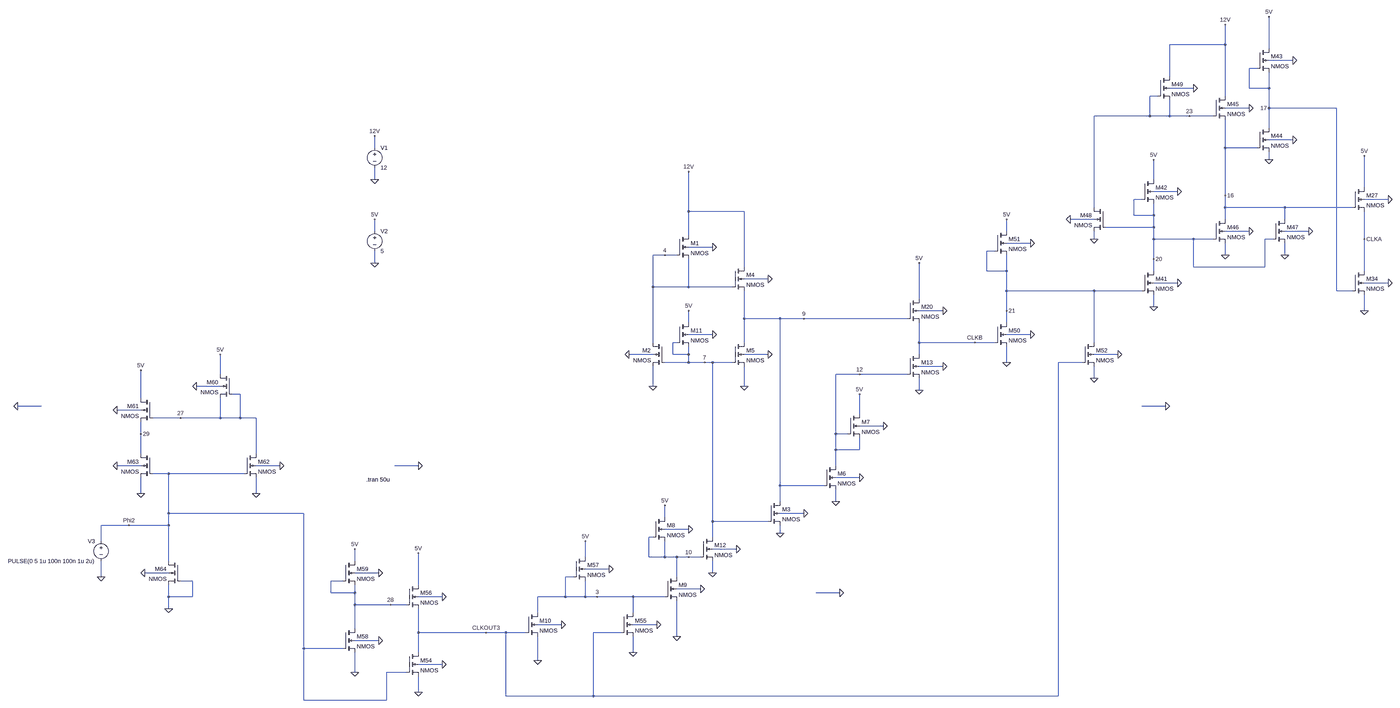
[diagram p0: schematic CLKIN.asc, whole sheet]
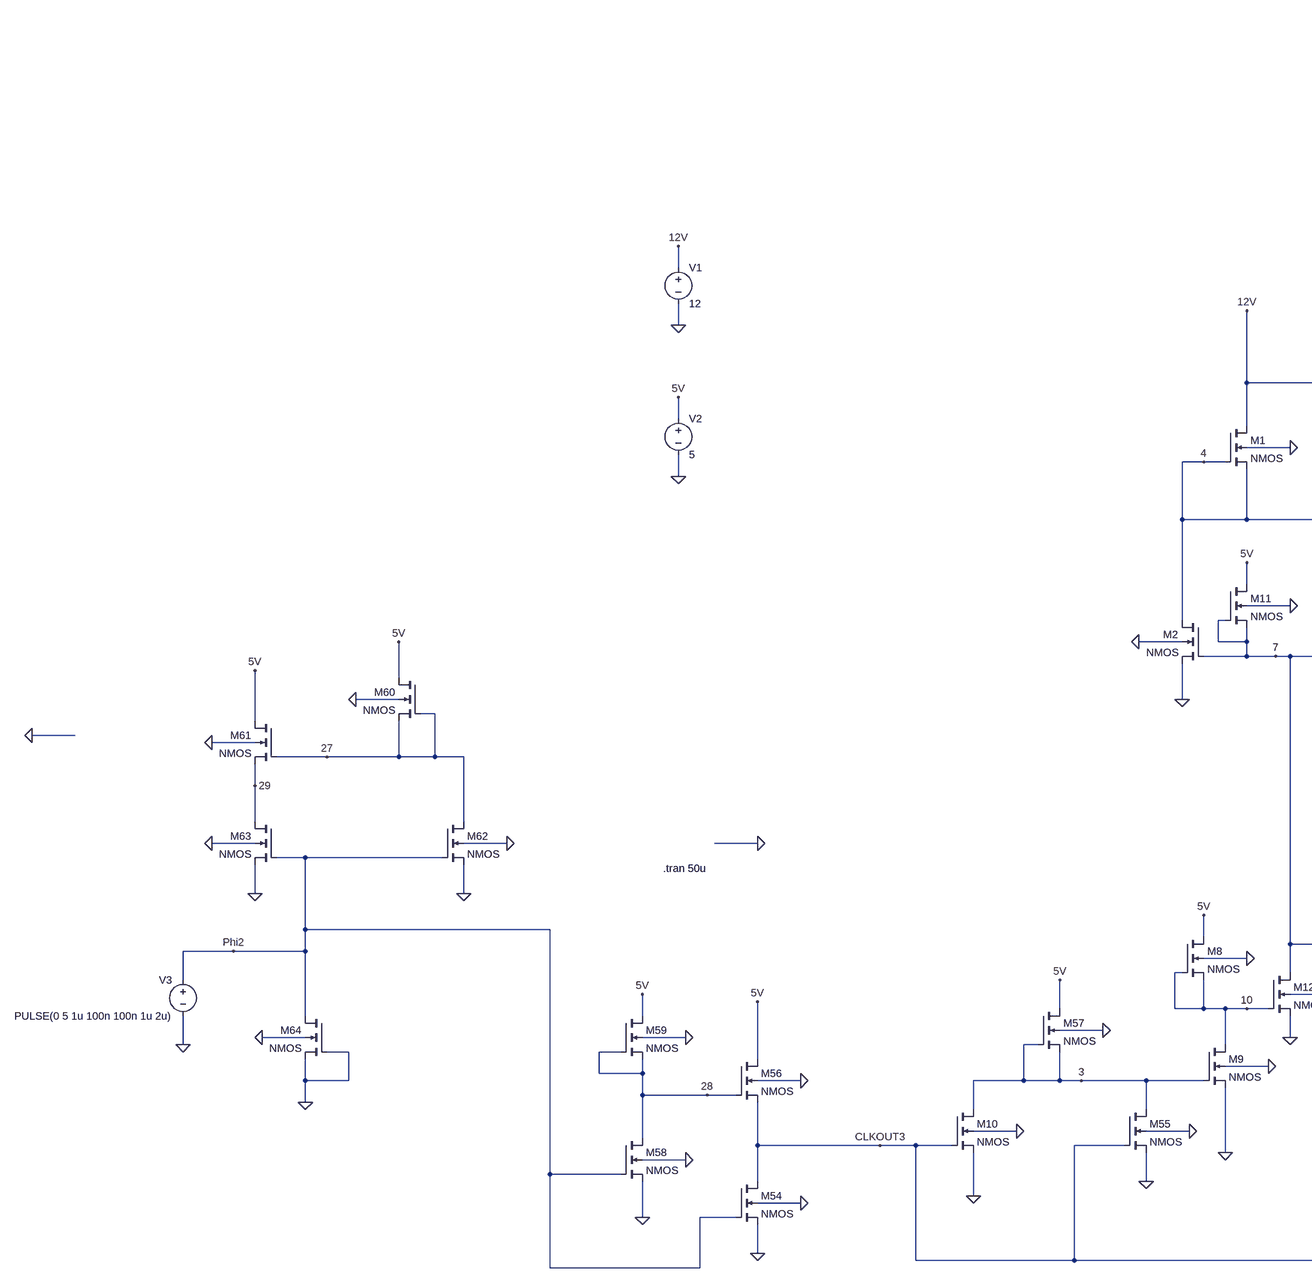
[diagram p1: schematic CLKIN.asc, part, row 1 of 1, column 1 of 2]
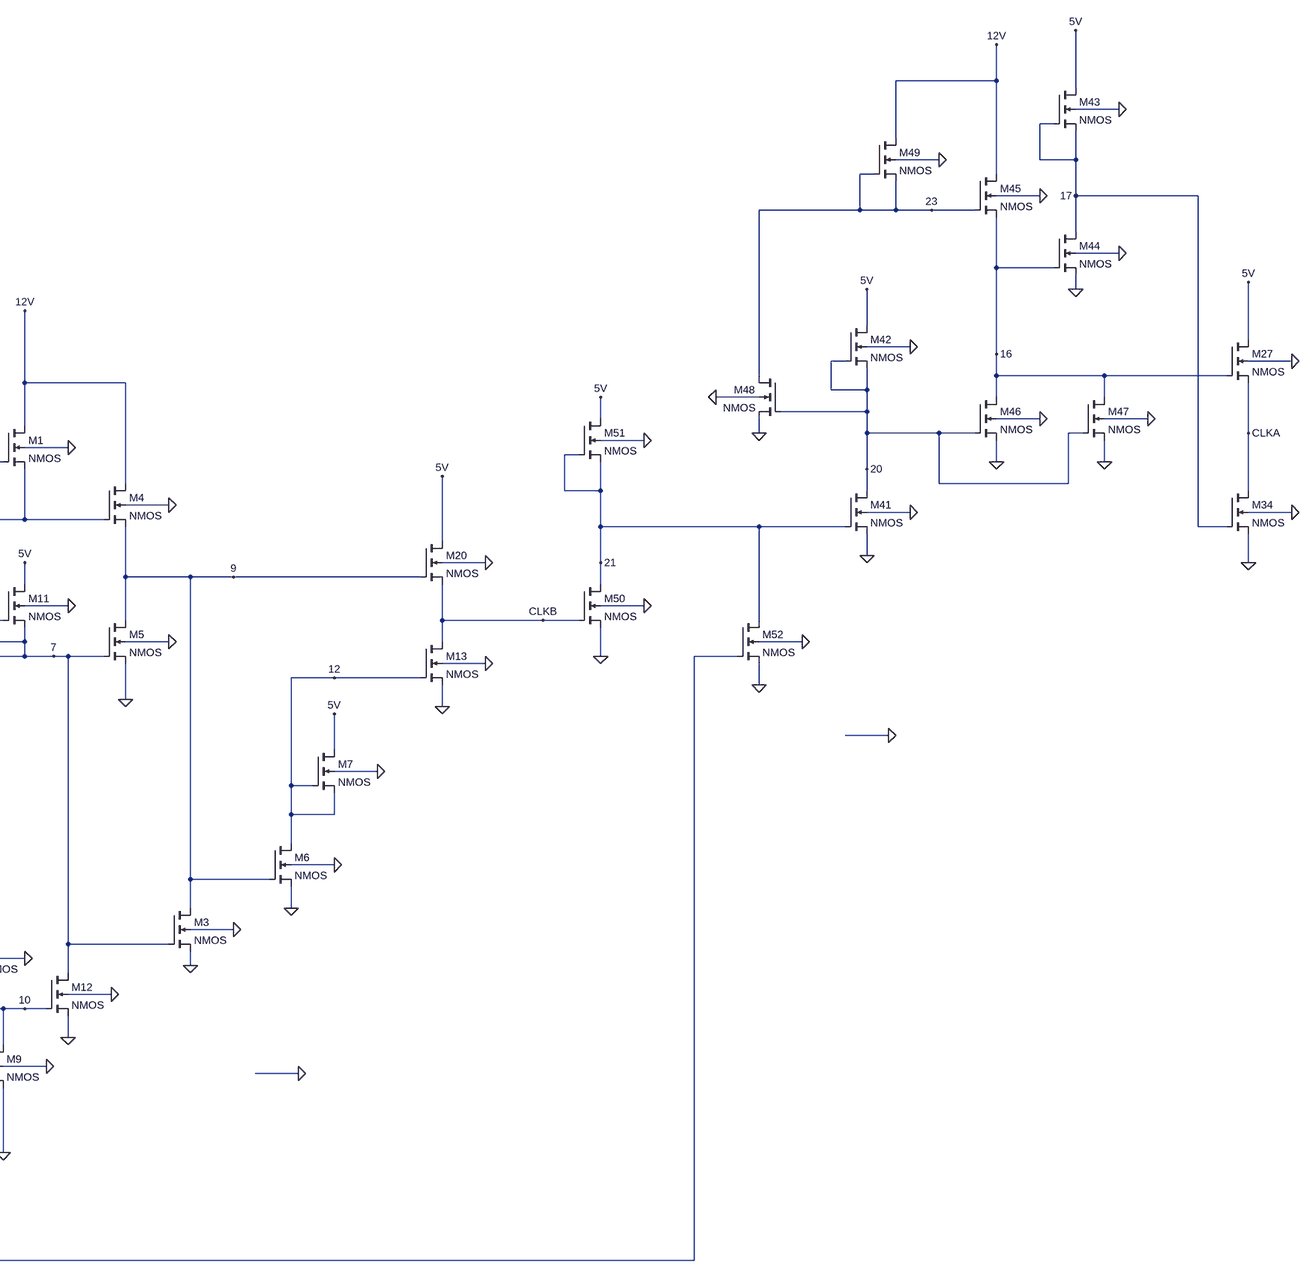
[diagram p2: schematic CLKIN.asc, part, row 1 of 1, column 2 of 2]
CLKIN.asc, the LTspice schematic file:
Version 4
SHEET 1 5776 3604
WIRE 2368 -640 2368 -720
WIRE 2368 -640 2144 -640
WIRE 2544 -624 2544 -752
WIRE 2640 -576 2544 -576
WIRE 2496 -544 2464 -544
WIRE 2144 -512 2144 -640
WIRE 2240 -464 2144 -464
WIRE 2464 -464 2464 -544
WIRE 2544 -464 2544 -528
WIRE 2544 -464 2464 -464
WIRE 2096 -432 2064 -432
WIRE 2368 -432 2368 -640
WIRE 2464 -384 2368 -384
WIRE 2544 -384 2544 -464
WIRE 2816 -384 2544 -384
WIRE 2064 -352 2064 -432
WIRE 2064 -352 1840 -352
WIRE 2144 -352 2144 -416
WIRE 2144 -352 2064 -352
WIRE 2224 -352 2144 -352
WIRE 2320 -352 2224 -352
WIRE 2544 -304 2544 -384
WIRE 2640 -256 2544 -256
WIRE -1296 -224 -1296 -272
WIRE 2368 -224 2368 -336
WIRE 2496 -224 2368 -224
WIRE 2544 -176 2544 -208
WIRE -1296 -96 -1296 -144
WIRE 2080 -96 2080 -176
WIRE 2928 -64 2928 -192
WIRE 2176 -48 2080 -48
WIRE 2368 -32 2368 -224
WIRE 2032 -16 2000 -16
WIRE 3024 -16 2928 -16
WIRE 1840 16 1840 -352
WIRE 2368 16 2368 -32
WIRE 2608 16 2368 16
WIRE 2880 16 2608 16
WIRE 208 32 208 -128
WIRE 432 32 208 32
WIRE 2000 48 2000 -16
WIRE 2080 48 2080 0
WIRE 2080 48 2000 48
WIRE 1840 64 1744 64
WIRE 2368 64 2368 16
WIRE 2608 64 2608 16
WIRE 2080 96 2080 48
WIRE 2080 96 1888 96
WIRE -1296 112 -1296 64
WIRE 1488 112 1488 64
WIRE 2464 112 2368 112
WIRE 2704 112 2608 112
WIRE 208 128 208 32
WIRE 1840 144 1840 112
WIRE 2080 144 2080 96
WIRE 2240 144 2080 144
WIRE 2320 144 2240 144
WIRE 2560 144 2528 144
WIRE 2928 144 2928 32
WIRE 1584 160 1488 160
WIRE 304 176 208 176
WIRE 1440 192 1408 192
WIRE 112 208 64 208
WIRE 160 208 112 208
WIRE 2368 208 2368 160
WIRE 2608 208 2608 160
WIRE 2080 224 2080 144
WIRE -1296 240 -1296 192
WIRE 432 256 432 32
WIRE 2240 256 2240 144
WIRE 2528 256 2528 144
WIRE 2528 256 2240 256
WIRE 1408 272 1408 192
WIRE 1488 272 1488 208
WIRE 1488 272 1408 272
WIRE 2080 272 2080 224
WIRE 2928 272 2928 144
WIRE 528 304 432 304
WIRE 2176 320 2080 320
WIRE 3024 320 2928 320
WIRE 64 336 64 208
WIRE 208 336 208 224
WIRE 208 336 64 336
WIRE 384 336 208 336
WIRE 1488 352 1488 272
WIRE 1840 352 1488 352
WIRE 2032 352 1840 352
WIRE 2816 352 2816 -384
WIRE 2880 352 2816 352
WIRE 1136 384 1136 240
WIRE 2080 416 2080 368
WIRE 1232 432 1136 432
WIRE 1488 432 1488 352
WIRE 2928 432 2928 368
WIRE 432 464 432 352
WIRE 576 464 432 464
WIRE 672 464 576 464
WIRE 1088 464 672 464
WIRE 208 480 208 432
WIRE 1488 480 1488 432
WIRE 304 528 208 528
WIRE 1584 528 1488 528
WIRE 64 560 64 336
WIRE 160 560 144 560
WIRE 432 560 432 464
WIRE 1136 560 1136 480
WIRE 1360 560 1136 560
WIRE 1440 560 1360 560
WIRE 1840 560 1840 352
WIRE 64 608 -32 608
WIRE 144 608 144 560
WIRE 208 608 208 576
WIRE 208 608 144 608
WIRE 528 608 432 608
WIRE 1136 608 1136 560
WIRE 1936 608 1840 608
WIRE 208 640 208 608
WIRE 208 640 112 640
WIRE 272 640 208 640
WIRE 304 640 272 640
WIRE 384 640 304 640
WIRE 1488 640 1488 576
WIRE 1792 640 1696 640
WIRE 1232 656 1136 656
WIRE -1984 688 -1984 608
WIRE 896 688 800 688
WIRE 1088 688 896 688
WIRE 1840 704 1840 656
WIRE -1984 736 -2080 736
WIRE 64 736 64 656
WIRE 432 736 432 656
WIRE 1136 752 1136 704
WIRE -1904 768 -1936 768
WIRE -2304 784 -2304 672
WIRE -2704 816 -2800 816
WIRE 2128 816 2032 816
WIRE -2304 832 -2400 832
WIRE 896 848 896 768
WIRE -2144 864 -2256 864
WIRE -1984 864 -1984 784
WIRE -1984 864 -2144 864
WIRE -1904 864 -1904 768
WIRE -1904 864 -1984 864
WIRE -1840 864 -1904 864
WIRE 992 896 896 896
WIRE -2304 928 -2304 880
WIRE 800 928 800 688
WIRE 848 928 800 928
WIRE 800 992 800 928
WIRE 896 992 896 944
WIRE 896 992 800 992
WIRE -2304 1008 -2304 928
WIRE -1840 1008 -1840 864
WIRE -2304 1056 -2400 1056
WIRE -1744 1056 -1840 1056
WIRE -1120 1056 -1216 1056
WIRE 800 1056 800 992
WIRE -2192 1088 -2256 1088
WIRE -1888 1088 -2192 1088
WIRE 896 1104 800 1104
WIRE 576 1136 576 464
WIRE 752 1136 576 1136
WIRE -2304 1168 -2304 1104
WIRE -1840 1168 -1840 1104
WIRE 576 1200 576 1136
WIRE 800 1200 800 1152
WIRE -2192 1248 -2192 1088
WIRE -1648 1248 -2192 1248
WIRE 672 1248 576 1248
WIRE 112 1264 112 1216
WIRE 304 1280 304 640
WIRE 528 1280 304 1280
WIRE -2352 1296 -2464 1296
WIRE -2192 1296 -2192 1248
WIRE -2192 1296 -2352 1296
WIRE 208 1312 112 1312
WIRE 576 1328 576 1296
WIRE 64 1344 48 1344
WIRE 304 1344 304 1280
WIRE -2464 1360 -2464 1296
WIRE 400 1392 304 1392
WIRE -208 1424 -208 1360
WIRE 48 1424 48 1344
WIRE 112 1424 112 1360
WIRE 112 1424 48 1424
WIRE 160 1424 112 1424
WIRE 208 1424 160 1424
WIRE 256 1424 208 1424
WIRE -2192 1440 -2192 1296
WIRE -1376 1440 -1376 1392
WIRE -112 1472 -208 1472
WIRE -2192 1488 -2288 1488
WIRE -1280 1488 -1376 1488
WIRE 304 1488 304 1440
WIRE -2464 1504 -2464 1440
WIRE -256 1504 -288 1504
WIRE 160 1504 160 1424
WIRE -2096 1520 -2144 1520
WIRE -1424 1520 -1472 1520
WIRE -1120 1536 -1120 1408
WIRE 256 1552 160 1552
WIRE -1472 1568 -1472 1520
WIRE -1376 1568 -1376 1536
WIRE -1376 1568 -1472 1568
WIRE 816 1568 720 1568
WIRE -2192 1584 -2192 1536
WIRE -2096 1584 -2096 1520
WIRE -2096 1584 -2192 1584
WIRE -1024 1584 -1120 1584
WIRE -288 1584 -288 1504
WIRE -288 1584 -400 1584
WIRE -208 1584 -208 1520
WIRE -208 1584 -288 1584
WIRE -160 1584 -208 1584
WIRE -16 1584 -160 1584
WIRE 112 1584 -16 1584
WIRE -1376 1616 -1376 1568
WIRE -1232 1616 -1376 1616
WIRE -1168 1616 -1232 1616
WIRE -2192 1632 -2192 1584
WIRE -400 1648 -400 1584
WIRE -16 1648 -16 1584
WIRE -304 1696 -400 1696
WIRE 80 1696 -16 1696
WIRE -1376 1712 -1376 1616
WIRE -1120 1728 -1120 1632
WIRE -608 1728 -1120 1728
WIRE -528 1728 -608 1728
WIRE -448 1728 -528 1728
WIRE -64 1728 -176 1728
WIRE 160 1744 160 1600
WIRE -1280 1760 -1376 1760
WIRE -1648 1792 -1648 1248
WIRE -1424 1792 -1648 1792
WIRE -1120 1808 -1120 1728
WIRE -16 1808 -16 1744
WIRE -400 1840 -400 1744
WIRE -1024 1856 -1120 1856
WIRE -1376 1888 -1376 1808
WIRE -1168 1888 -1248 1888
WIRE -1120 1968 -1120 1904
WIRE -528 1984 -528 1728
WIRE -176 1984 -176 1728
WIRE -176 1984 -528 1984
WIRE 1696 1984 1696 640
WIRE 1696 1984 -176 1984
WIRE -1648 2000 -1648 1792
WIRE -1248 2000 -1248 1888
WIRE -1248 2000 -1648 2000
FLAG 208 -128 12V
FLAG 112 208 4
FLAG 672 464 9
FLAG 432 736 0
FLAG 272 640 7
FLAG 1360 560 CLKB
FLAG 1136 240 5V
FLAG 896 688 12
FLAG 800 1200 0
FLAG 576 1328 0
FLAG 64 736 0
FLAG 208 432 5V
FLAG -1296 -96 0
FLAG -1296 240 0
FLAG -1296 -272 12V
FLAG -1296 64 5V
FLAG 304 1488 0
FLAG 208 1424 10
FLAG 896 768 5V
FLAG 112 1216 5V
FLAG 160 1744 0
FLAG -160 1584 3
FLAG -208 1360 5V
FLAG -608 1728 CLKOUT3
FLAG -400 1840 0
FLAG -2464 1504 0
FLAG 1488 432 21
FLAG 1488 640 0
FLAG 1136 752 0
FLAG 1488 64 5V
FLAG 1840 704 0
FLAG 2080 416 0
FLAG 2080 224 20
FLAG 2080 -176 5V
FLAG 304 176 0
FLAG 528 304 0
FLAG -32 608 0
FLAG 528 608 0
FLAG 304 528 0
FLAG 2368 208 0
FLAG 2368 -32 16
FLAG 2608 208 0
FLAG 2928 -192 5V
FLAG 2928 144 CLKA
FLAG 2544 -176 0
FLAG 2544 -384 17
FLAG 2368 -720 12V
FLAG 2224 -352 23
FLAG 1840 144 0
FLAG 2544 -752 5V
FLAG 2928 432 0
FLAG 2240 -464 0
FLAG 2128 816 0
FLAG 2176 -48 0
FLAG 1744 64 0
FLAG 2640 -256 0
FLAG 2640 -576 0
FLAG 2464 -384 0
FLAG 2464 112 0
FLAG 2704 112 0
FLAG 3024 -16 0
FLAG 3024 320 0
FLAG 1936 608 0
FLAG 2176 320 0
FLAG 1584 160 0
FLAG 1584 528 0
FLAG 1232 656 0
FLAG 1232 432 0
FLAG 992 896 0
FLAG 896 1104 0
FLAG 672 1248 0
FLAG 400 1392 0
FLAG 816 1568 0
FLAG 256 1552 0
FLAG 208 1312 0
FLAG -112 1472 0
FLAG -304 1696 0
FLAG -2352 1296 Phi2
FLAG -2192 1632 0
FLAG -2304 928 29
FLAG -2304 672 5V
FLAG -2144 864 27
FLAG -2304 1168 0
FLAG -1840 1168 0
FLAG -1120 1968 0
FLAG -1120 1408 5V
FLAG -1232 1616 28
FLAG -1376 1888 0
FLAG -1376 1392 5V
FLAG -16 1808 0
FLAG 80 1696 0
FLAG -1984 608 5V
FLAG -2080 736 0
FLAG -2400 832 0
FLAG -2800 816 0
FLAG -2288 1488 0
FLAG -1744 1056 0
FLAG -1120 1056 0
FLAG -1280 1488 0
FLAG -1280 1760 0
FLAG -1024 1584 0
FLAG -1024 1856 0
FLAG -2400 1056 0
SYMBOL nmos4 160 128 R0
SYMATTR InstName M1
SYMBOL nmos4 384 256 R0
SYMATTR InstName M4
SYMBOL nmos4 2096 -512 R0
SYMATTR InstName M49
SYMBOL nmos4 384 560 R0
SYMATTR InstName M5
SYMBOL nmos4 1088 384 R0
SYMATTR InstName M20
SYMBOL nmos4 112 560 M0
SYMATTR InstName M2
SYMBOL nmos4 528 1200 R0
SYMATTR InstName M3
SYMBOL nmos4 752 1056 R0
SYMATTR InstName M6
SYMBOL nmos4 160 480 R0
SYMATTR InstName M11
SYMBOL voltage -1296 -240 R0
WINDOW 123 0 0 Left 0
WINDOW 39 0 0 Left 0
SYMATTR InstName V1
SYMATTR Value 12
SYMBOL voltage -1296 96 R0
SYMATTR InstName V2
SYMATTR Value 5
SYMBOL nmos4 256 1344 R0
SYMATTR InstName M12
SYMBOL nmos4 848 848 R0
SYMATTR InstName M7
SYMBOL nmos4 64 1264 R0
SYMATTR InstName M8
SYMBOL nmos4 112 1504 R0
SYMATTR InstName M9
SYMBOL nmos4 -256 1424 R0
SYMATTR InstName M57
SYMBOL nmos4 -448 1648 R0
SYMATTR InstName M10
SYMBOL voltage -2464 1344 M0
WINDOW 123 0 0 Left 0
WINDOW 39 0 0 Left 0
SYMATTR InstName V3
SYMATTR Value PULSE(0 5 1u 100n 100n 1u 2u)
SYMBOL nmos4 1440 480 R0
SYMATTR InstName M50
SYMBOL nmos4 1088 608 R0
SYMATTR InstName M13
SYMBOL nmos4 1440 112 R0
SYMATTR InstName M51
SYMBOL nmos4 1792 560 R0
SYMATTR InstName M52
SYMBOL nmos4 2032 272 R0
SYMATTR InstName M41
SYMBOL nmos4 2032 -96 R0
SYMATTR InstName M42
SYMBOL nmos4 2320 64 R0
SYMATTR InstName M46
SYMBOL nmos4 2560 64 R0
SYMATTR InstName M47
SYMBOL nmos4 2880 -64 R0
SYMATTR InstName M27
SYMBOL nmos4 2496 -304 R0
SYMATTR InstName M44
SYMBOL nmos4 2320 -432 R0
SYMATTR InstName M45
SYMBOL nmos4 1888 16 M0
SYMATTR InstName M48
SYMBOL nmos4 2496 -624 R0
SYMATTR InstName M43
SYMBOL nmos4 2880 272 R0
SYMATTR InstName M34
SYMBOL nmos4 -2144 1440 M0
SYMATTR InstName M64
SYMBOL nmos4 -2256 1008 M0
SYMATTR InstName M63
SYMBOL nmos4 -2256 784 M0
SYMATTR InstName M61
SYMBOL nmos4 -1888 1008 R0
SYMATTR InstName M62
SYMBOL nmos4 -1168 1808 R0
SYMATTR InstName M54
SYMBOL nmos4 -1424 1712 R0
SYMATTR InstName M58
SYMBOL nmos4 -1168 1536 R0
SYMATTR InstName M56
SYMBOL nmos4 -1424 1440 R0
SYMATTR InstName M59
SYMBOL nmos4 -64 1648 R0
SYMATTR InstName M55
SYMBOL nmos4 -1936 688 M0
SYMATTR InstName M60
TEXT -1330 1112 Left 2 !.tran 50u

The netlist it stands for:
* CLKIN.asc
M1 12V 4 4 0 NMOS
M4 12V 4 9 0 NMOS
M49 12V 23 23 0 NMOS
M5 9 7 0 0 NMOS
M20 5V 9 CLKB 0 NMOS
M2 4 7 0 0 NMOS
M3 9 7 0 0 NMOS
M6 12 9 0 0 NMOS
M11 5V 7 7 0 NMOS
V1 12V 0 12
V2 5V 0 5
M12 7 10 0 0 NMOS
M7 5V 12 12 0 NMOS
M8 5V 10 10 0 NMOS
M9 10 3 0 0 NMOS
M57 5V 3 3 0 NMOS
M10 3 CLKOUT3 0 0 NMOS
V3 Phi2 0 PULSE(0 5 1u 100n 100n 1u 2u)
M50 21 CLKB 0 0 NMOS
M13 CLKB 12 0 0 NMOS
M51 5V 21 21 0 NMOS
M52 21 CLKOUT3 0 0 NMOS
M41 20 21 0 0 NMOS
M42 5V 20 20 0 NMOS
M46 16 20 0 0 NMOS
M47 16 20 0 0 NMOS
M27 5V 16 CLKA 0 NMOS
M44 17 16 0 0 NMOS
M45 12V 23 16 0 NMOS
M48 23 20 0 0 NMOS
M43 5V 17 17 0 NMOS
M34 CLKA 17 0 0 NMOS
M64 Phi2 0 0 0 NMOS
M63 29 Phi2 0 0 NMOS
M61 5V 27 29 0 NMOS
M62 27 Phi2 0 0 NMOS
M54 CLKOUT3 Phi2 0 0 NMOS
M58 28 Phi2 0 0 NMOS
M56 5V 28 CLKOUT3 0 NMOS
M59 5V 28 28 0 NMOS
M55 3 CLKOUT3 0 0 NMOS
M60 5V 27 27 0 NMOS
.model NMOS NMOS
.model PMOS PMOS
.lib standard.mos
.tran 50u
.backanno
.end